# EAGLE design center_panel (EAGLE 9.6.2)
REV: p2; TITLE: Elemental Center
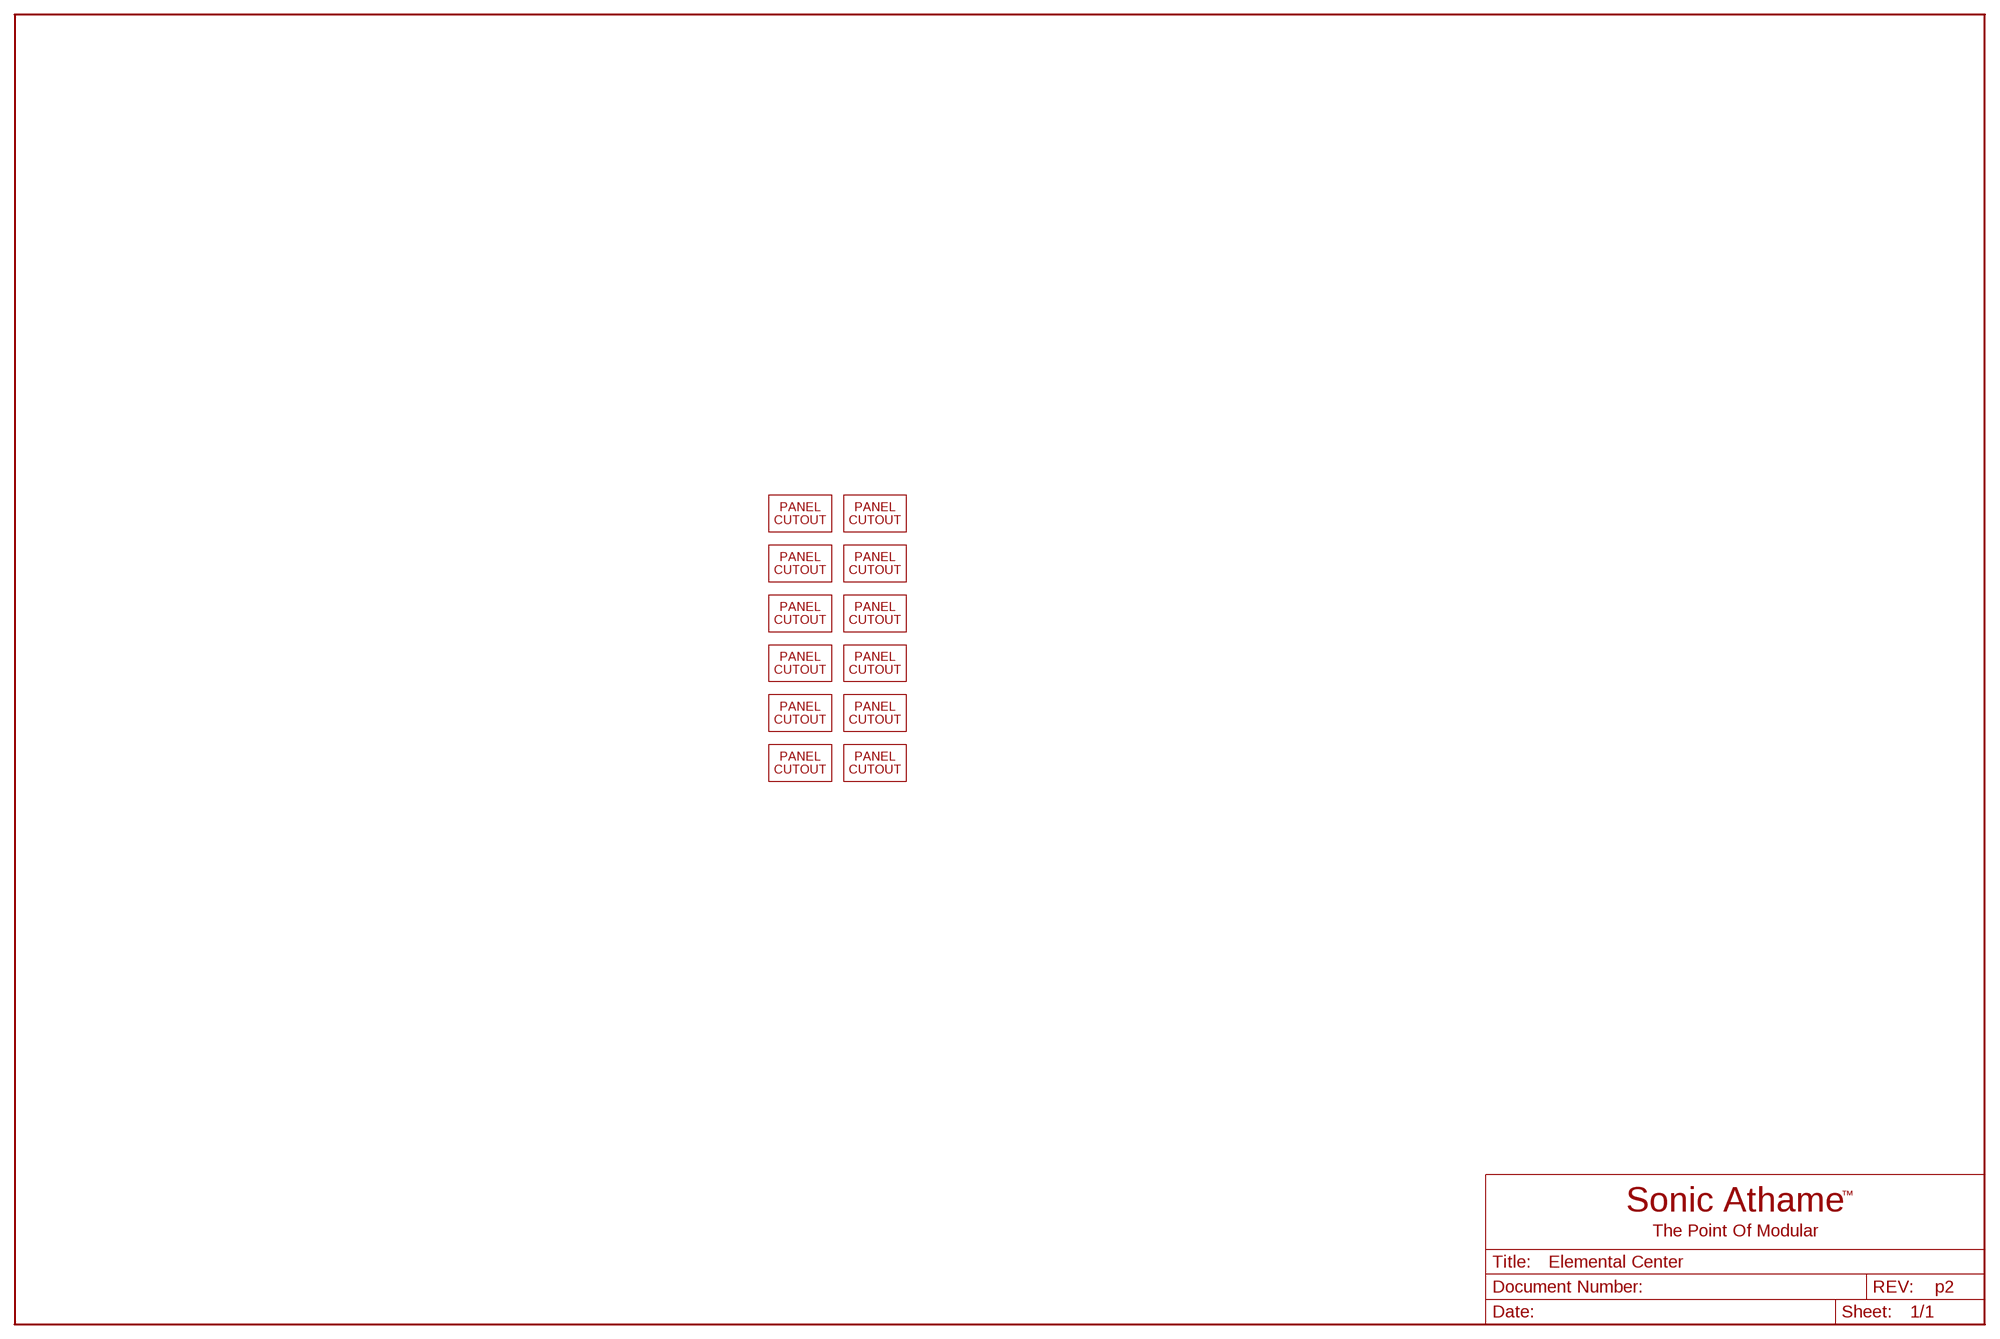
[diagram p0: schematic, sheet 1]

## Parts
CUTOUT1  PANEL_CUTOUTSWQP-PJ398SM  [WQP-PJ398SM_PANEL]
CUTOUT2  PANEL_CUTOUTSWQP-PJ398SM  [WQP-PJ398SM_PANEL]
CUTOUT3  PANEL_CUTOUTSWQP-PJ398SM  [WQP-PJ398SM_PANEL]
CUTOUT4  PANEL_CUTOUTSWQP-PJ398SM  [WQP-PJ398SM_PANEL]
CUTOUT5  PANEL_CUTOUTSWQP-PJ398SM  [WQP-PJ398SM_PANEL]
CUTOUT6  PANEL_CUTOUTSWQP-PJ398SM  [WQP-PJ398SM_PANEL]
CUTOUT7  PANEL_CUTOUTSWQP-PJ398SM  [WQP-PJ398SM_PANEL]
CUTOUT8  PANEL_CUTOUTSWQP-PJ398SM  [WQP-PJ398SM_PANEL]
CUTOUT9  PANEL_CUTOUTSWQP-PJ398SM  [WQP-PJ398SM_PANEL]
CUTOUT10  PANEL_CUTOUTSWQP-PJ398SM  [WQP-PJ398SM_PANEL]
CUTOUT11  PANEL_CUTOUTSWQP-PJ398SM  [WQP-PJ398SM_PANEL]
CUTOUT12  PANEL_CUTOUTSWQP-PJ398SM  [WQP-PJ398SM_PANEL]

## Library data of the parts
CUTOUT1-CUTOUT12 = SonicAthame:PANEL_CUTOUTS

## Board
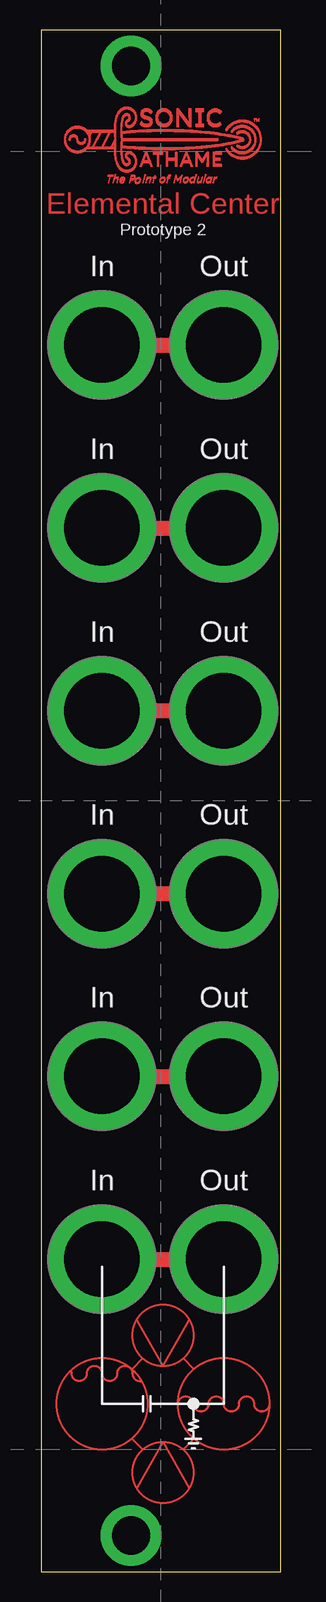
[diagram p1: board, top side]

Size 20 x 128.5 mm. Coordinates in mm from the lower left corner, seen from the top.
Copper layers (1*16): Top 0.035mm / dielectric 1.5mm / Bottom 0.035mm
Design rules "default *": minimum track width 5mil, minimum drill 0.35mm, track to track 6mil, track to pad 6mil, pad to pad 6mil, via to via 6mil, smd to smd 6mil, copper to edge 0.2mm, drill to drill 0.5mm, minimum pad ring 10mil, minimum via ring 8mil, stop-mask expansion 4mil, vias tented up to drill 0mil, thermal gap 10mil

### Footprints (pad centres in the part's own frame; a part is rotated, then mirrored left to right if it is on the bottom)
WQP-PJ398SM_PANEL = drill 6.3 pad 9: NC 0,0
PANEL_4U = drill 3.2 pad 5.08: NC1 7.5,125.5; NC2 7.5,3

### Placement (x,y rotation side)
CUTOUT1  5.08,102.23 0 top
CUTOUT2  15.24,102.23 0 top
CUTOUT3  15.24,87 0 top
CUTOUT4  5.08,87 0 top
CUTOUT5  15.24,71.75 0 top
CUTOUT6  5.08,71.75 0 top
CUTOUT7  15.24,56.52 0 top
CUTOUT8  5.08,56.52 0 top
CUTOUT9  15.24,41.27 0 top
CUTOUT10  5.08,41.27 0 top
CUTOUT11  15.24,26.04 0 top
CUTOUT12  5.08,26.04 0 top
U$1  [PANEL_4U]  0,0 0 top
U$2  [LOGO-65MIL-TPAD]  10.16,119.38 0 top

### Tracks (layer width: path | path; a pad name or v marks a point on that pad's centre or on a via)
N$1
  Top 0.152: 5.08,17.78 5.08,25.78
N$2
  Top 0.152: 12.32,20.95 10.16,17.14 8,20.95
N$3
  Top 0.152: 3.81,16.51 arc-180 2.54,16.51
N$4
  Top 0.152: 3.81,16.51 arc-180 5.08,16.51
N$5
  Top 0.152: 6.35,16.51 arc-180 5.08,16.51
N$6
  Top 0.152: 2.46,16.71 arc-37 2.54,16.51
N$7
  Top 0.152: 15.24,17.78 15.24,25.91
N$8
  Top 0.152: 7.62,16.51 arc100 8.38,15.88
N$9
  Top 0.152: 2.54,16.51 arc30 2.46,16.71
N$10
  Top 0.152: 8,6.99 10.16,10.79 12.32,6.99
N$11
  Top 0.152: 6.35,16.51 arc-180 7.62,16.51
N$12
  Top 0.152: 13.97,13.97 arc-180 15.24,13.97
N$13
  Top 0.152: 16.51,13.97 arc-180 15.24,13.97
N$14
  Top 0.152: 13.97,13.97 arc-180 12.7,13.97
N$15
  Top 0.152: 16.51,13.97 arc-180 17.78,13.97
N$16
  Top 0.152: 11.43,13.97 arc-180 12.7,13.97
N$17
  Top 0.152: 19.05,13.97 arc-180 17.78,13.97
N$18
  Top 0.152: 11.86,10.19 12.75,11.07
N$19
  Top 0.152: 8.46,10.19 7.57,11.07
N$20
  Top 0.152: 11.86,17.75 12.75,16.87
N$21
  Top 0.152: 8.46,17.75 7.57,16.87
N$22
  Top 1.27: 5.71,102.23 13.97,102.23
N$23
  Top 1.27: 5.71,87 13.97,87
N$24
  Top 1.27: 5.71,71.75 13.97,71.75
N$25
  Top 1.27: 5.71,56.52 13.97,56.52
N$26
  Top 1.27: 5.71,41.27 13.97,41.27
N$27
  Top 1.27: 5.71,26.04 13.97,26.04
(copper drawn outside any net)
  shapes: Top circle x4

### Text on the board
Top: Elemental Center
tNames: Prototype 2 | In | Out | In | Out | In | Out | In | Out | In | Out | In | Out
tStop: Elemental Center